# Altium schematic sheet Microcontroller (F446).SchDoc
size A3
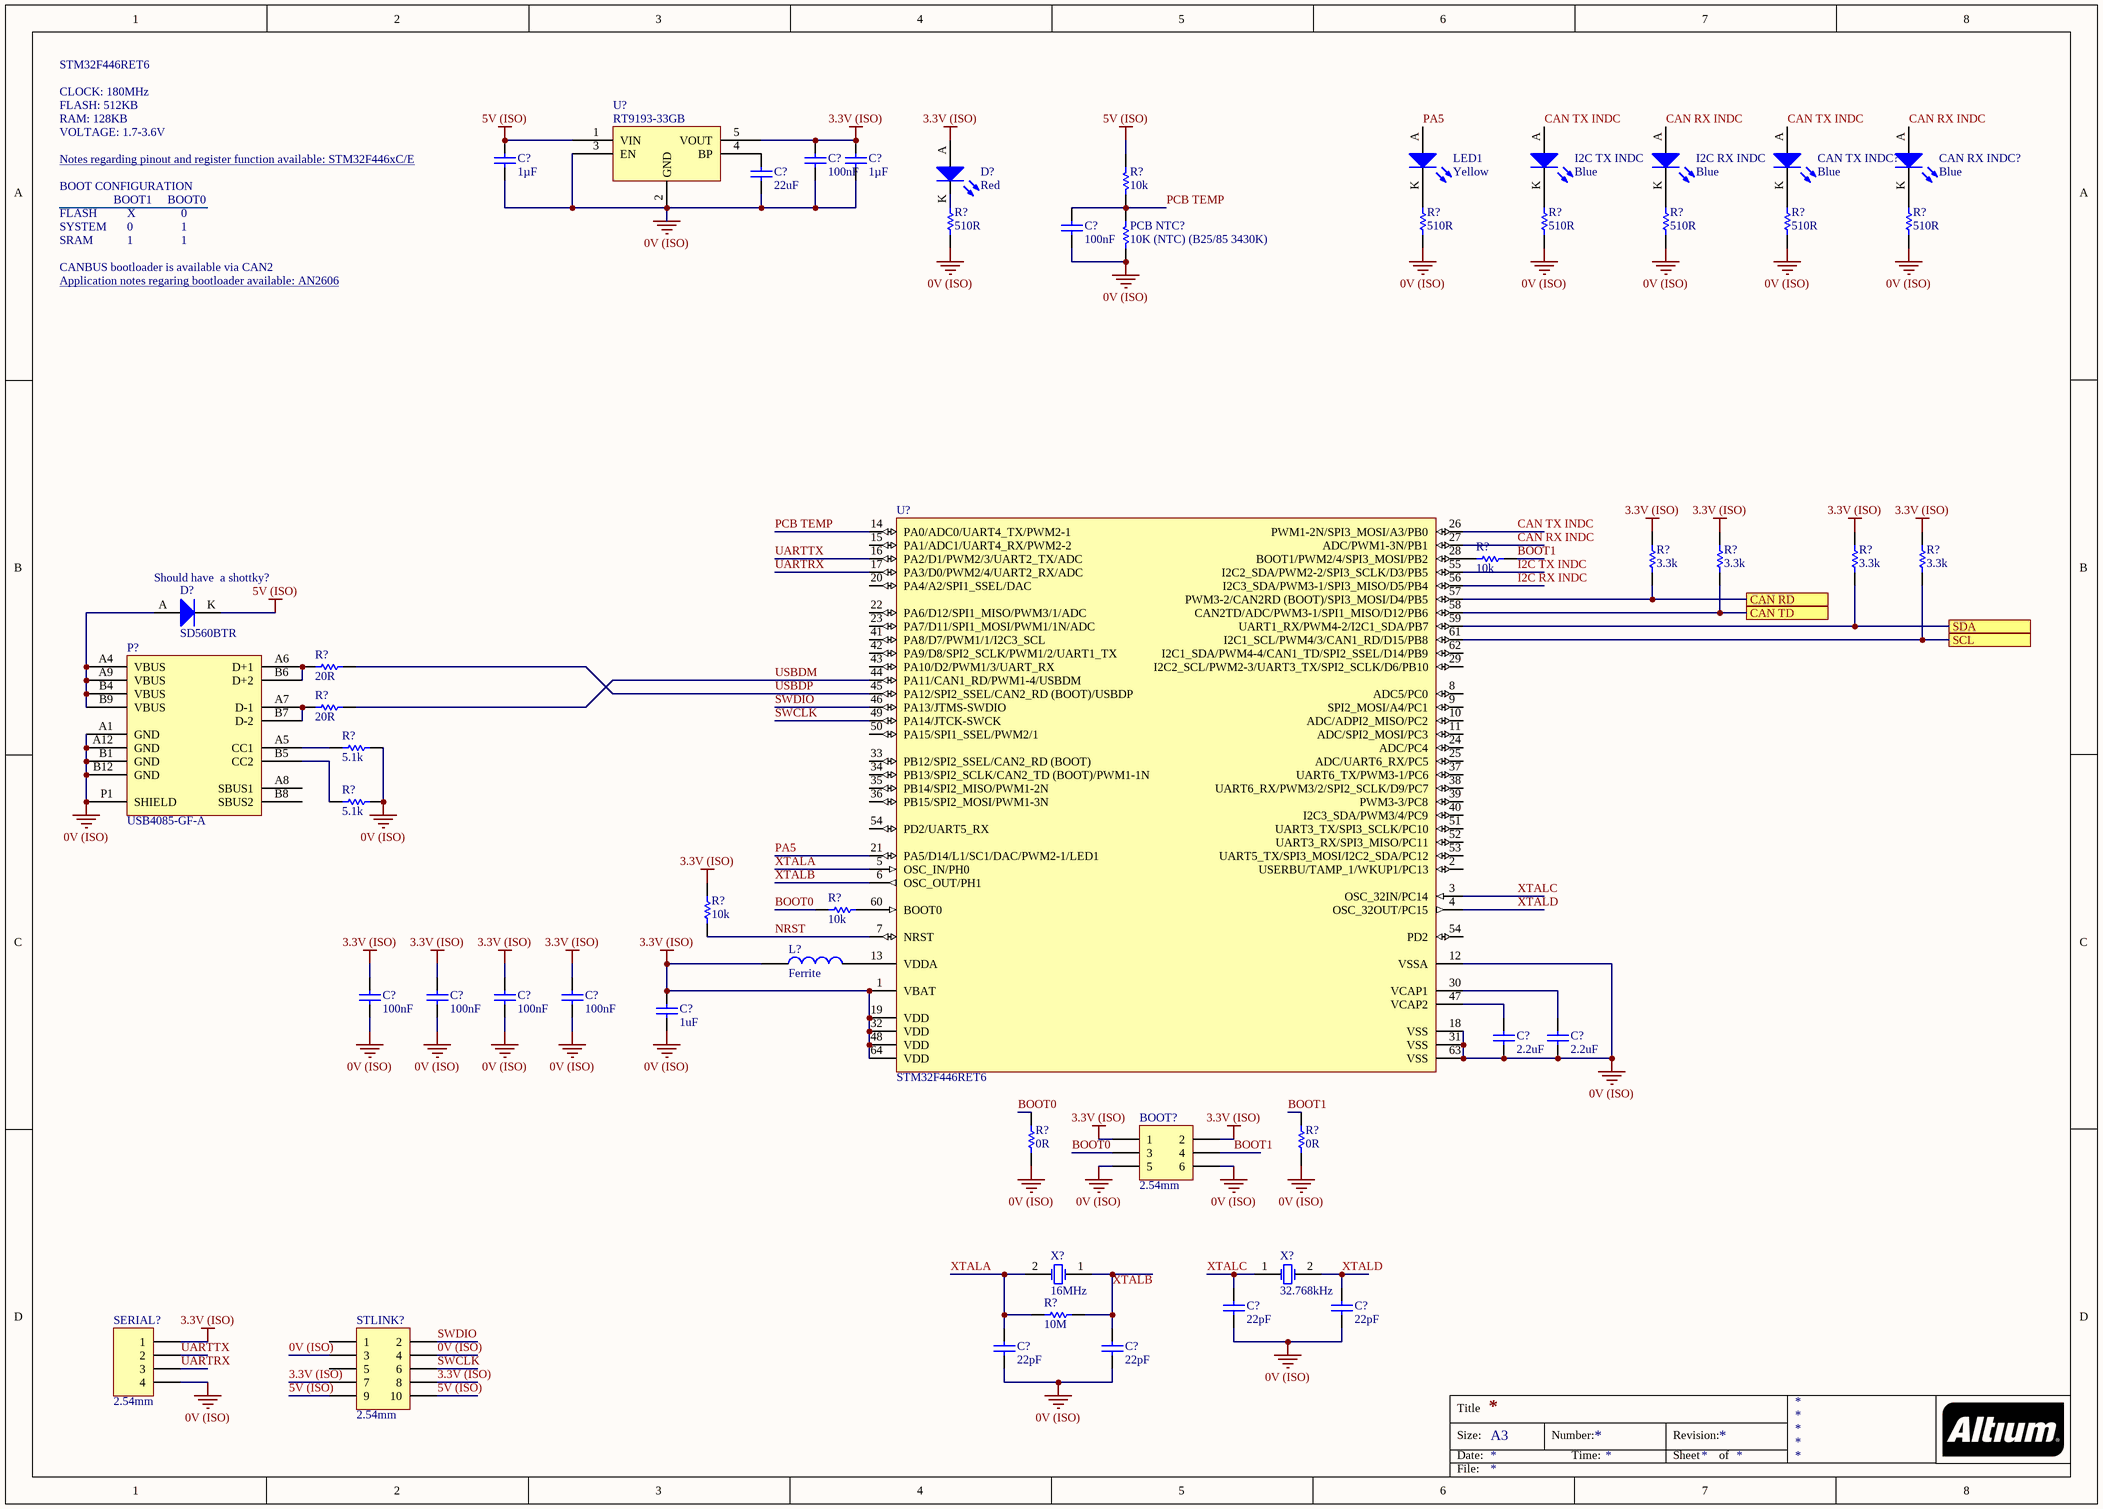
[diagram p0: Microcontroller (F446).SchDoc]

## Parts
(Parts that share a designator on the sheet are numbered #1, #2 ... from top to bottom, then left to right.)
BOOT?  2.54mm  [TH 2.54mm Header 2x3]
C?#1  1µF  [0805]
C?#2  100nF  [0805]
C?#3  1µF  [0805]
C?#4  22uF  [0805]
C?#5  100nF  [0805]
C?#6  100nF  [0805]
C?#7  100nF  [0805]
C?#8  100nF  [0805]
C?#9  100nF  [0805]
C?#10  1uF  [0805]
C?#11  2.2uF  [0805]
C?#12  2.2uF  [0805]
C?#13  22pF  [0805]
C?#14  22pF  [0805]
C?#15  22pF  [0805]
C?#16  22pF  [0805]
CAN_RX_INDC?  Blue  [0805 LED]
CAN_TX_INDC?  Blue  [0805 LED]
D?#1  Red  [0805 LED]
D?#2  SD560BTR  [SMB Diode]
I2C_RX_INDC  Blue  [0805 LED]
I2C_TX_INDC  Blue  [0805 LED]
L?  Ferrite  [0805]
LED1  Yellow  [0805 LED]
P?  USB4085-GF-A  [USB4085-GF-A]
PCB_NTC?  10K (NTC) (B25/85 3430K)  [0805]
R?#1  10k  [0805]
R?#2  510R  [0805]
R?#3  510R  [0805]
R?#4  510R  [0805]
R?#5  510R  [0805]
R?#6  510R  [0805]
R?#7  510R  [0805]
R?#8  10k  [0805]
R?#9  3.3k  [0805]
R?#10  3.3k  [0805]
R?#11  3.3k  [0805]
R?#12  3.3k  [0805]
R?#13  20R  [0805]
R?#14  20R  [0805]
R?#15  5.1k  [0805]
R?#16  5.1k  [0805]
R?#17  10k  [0805]
R?#18  10k  [0805]
R?#19  0R  [0805]
R?#20  0R  [0805]
R?#21  10M  [0805]
SERIAL?  2.54mm  [TH 2.54mm Header 1x4]
STLINK?  2.54mm  [TH 2.54mm Header 2x5]
U?#1  RT9193-33GB  [RICHTEK SOT-23-5]
U?#2  STM32F446RET6  [STM 64-LQFP]
X?#1  16MHz  [Abracon HC-49/US]
X?#2  32.768kHz  [EPSON 2-SMD]

## Ports
CAN RD, CAN TD, SCL, SDA

## Nets
0V (ISO): BOOT?.5 BOOT?.6 C?#1.1 C?#2.1 C?#3.1 C?#4.1 C?#5.1 C?#6.1 C?#7.1 C?#8.1 C?#9.1 C?#10.1 C?#11.1 C?#12.1 C?#13.1 C?#14.1 C?#15.1 C?#16.1 P?.A1(GND) P?.A12(GND) P?.B1(GND) P?.B12(GND) P?.P1(SHIELD) PCB_NTC?.1 R?#2.1 R?#3.1 R?#4.1 R?#5.1 R?#6.1 R?#7.1 R?#15.2 R?#16.2 R?#19.1 R?#20.1 SERIAL?.4 STLINK?.3 STLINK?.4 U?#1.2(GND) U?#1.3(EN) U?#2.12(VSSA) U?#2.18(VSS) U?#2.31(VSS) U?#2.63(VSS)
3.3V (ISO): BOOT?.1 BOOT?.2 C?#2.2 C?#3.2 C?#6.2 C?#7.2 C?#8.2 C?#9.2 C?#10.2 D?#1.A L?.2 R?#9.2 R?#10.2 R?#11.2 R?#12.2 R?#18.2 SERIAL?.1 STLINK?.7 STLINK?.8 U?#1.5(VOUT) U?#2.1(VBAT) U?#2.19(VDD) U?#2.32(VDD) U?#2.48(VDD) U?#2.64(VDD)
5V (ISO): C?#1.2 D?#2.K R?#1.2 STLINK?.9 STLINK?.10 U?#1.1(VIN)
BOOT0: BOOT?.3 R?#17.1 R?#19.2
BOOT1: BOOT?.4 R?#8.2 R?#20.2
CAN RD: R?#9.1 U?#2.57(PWM3-2/CAN2RD_(BOOT)/SPI3_MOSI/D4/PB5) ; port CAN RD
CAN RX INDC: CAN_RX_INDC?.A I2C_RX_INDC.A U?#2.27(ADC/PWM1-3N/PB1)
CAN TD: R?#10.1 U?#2.58(CAN2TD/ADC/PWM3-1/SPI1_MISO/D12/PB6) ; port CAN TD
CAN TX INDC: CAN_TX_INDC?.A I2C_TX_INDC.A U?#2.26(PWM1-2N/SPI3_MOSI/A3/PB0)
I2C RX INDC: U?#2.56(I2C3_SDA/PWM3-1/SPI3_MISO/D5/PB4)
I2C TX INDC: U?#2.55(I2C2_SDA/PWM2-2/SPI3_SCLK/D3/PB5)
NRST: R?#18.1 U?#2.7(NRST)
PA5: LED1.A U?#2.21(PA5/D14/L1/SC1/DAC/PWM2-1/LED1)
PCB TEMP: C?#5.2 PCB_NTC?.2 R?#1.1 U?#2.14(PA0/ADC0/UART4_TX/PWM2-1)
SCL: R?#12.1 U?#2.61(I2C1_SCL/PWM4/3/CAN1_RD/D15/PB8) ; port SCL
SDA: R?#11.1 U?#2.59(UART1_RX/PWM4-2/I2C1_SDA/PB7) ; port SDA
SWCLK: STLINK?.6 U?#2.49(PA14/JTCK-SWCK)
SWDIO: STLINK?.2 U?#2.46(PA13/JTMS-SWDIO)
UARTRX: SERIAL?.3 U?#2.17(PA3/D0/PWM2/4/UART2_RX/ADC)
UARTTX: SERIAL?.2 U?#2.16(PA2/D1/PWM2/3/UART2_TX/ADC)
USBDM: R?#14.2 U?#2.44(PA11/CAN1_RD/PWM1-4/USBDM)
USBDP: R?#13.2 U?#2.45(PA12/SPI2_SSEL/CAN2_RD_(BOOT)/USBDP)
XTALA: C?#15.2 R?#21.2 U?#2.5(OSC_IN/PH0) X?#1.2(OSC2)
XTALB: C?#16.2 R?#21.1 U?#2.6(OSC_OUT/PH1) X?#1.1(OSC1)
XTALC: C?#13.2 U?#2.3(OSC_32IN/PC14) X?#2.1(OSC1)
XTALD: C?#14.2 U?#2.4(OSC_32OUT/PC15) X?#2.2(OSC2)
NetC?#4_2: C?#4.2 U?#1.4(BP)
NetC?#11_2: C?#11.2 U?#2.47(VCAP2)
NetC?#12_2: C?#12.2 U?#2.30(VCAP1)
NetCAN_RX_INDC?_K: CAN_RX_INDC?.K R?#7.2
NetCAN_TX_INDC?_K: CAN_TX_INDC?.K R?#6.2
NetD?#1_K: D?#1.K R?#2.2
NetD?#2_A: D?#2.A P?.A4(VBUS) P?.A9(VBUS) P?.B4(VBUS) P?.B9(VBUS)
NetI2C_RX_INDC_K: I2C_RX_INDC.K R?#5.2
NetI2C_TX_INDC_K: I2C_TX_INDC.K R?#4.2
NetL?_1: L?.1 U?#2.13(VDDA)
NetLED1_K: LED1.K R?#3.2
NetP?_A5: P?.A5(CC1) R?#15.1
NetP?_A6: P?.A6(D+1) P?.B6(D+2) R?#13.1
NetP?_A7: P?.A7(D-1) P?.B7(D-2) R?#14.1
NetP?_B5: P?.B5(CC2) R?#16.1
NetR?#8_1: R?#8.1 U?#2.28(BOOT1/PWM2/4/SPI3_MOSI/PB2)
NetR?#17_2: R?#17.2 U?#2.60(BOOT0)

Not connected (* = marked no-connect by the designer): P? A8(SBUS1) B8(SBUS2); STLINK? 1 5; U?#2 2(USERBU/TAMP_1/WKUP1/PC13) 8(ADC5/PC0) 9(SPI2_MOSI/A4/PC1) 10(ADC/ADPI2_MISO/PC2) 11(ADC/SPI2_MOSI/PC3) 15(PA1/ADC1/UART4_RX/PWM2-2) 20(PA4/A2/SPI1_SSEL/DAC) 22(PA6/D12/SPI1_MISO/PWM3/1/ADC) 23(PA7/D11/SPI1_MOSI/PWM1/1N/ADC) 24(ADC/PC4) 25(ADC/UART6_RX/PC5) 29(I2C2_SCL/PWM2-3/UART3_TX/SPI2_SCLK/D6/PB10) 33(PB12/SPI2_SSEL/CAN2_RD_(BOOT)) 34(PB13/SPI2_SCLK/CAN2_TD_(BOOT)/PWM1-1N) 35(PB14/SPI2_MISO/PWM1-2N) 36(PB15/SPI2_MOSI/PWM1-3N) 37(UART6_TX/PWM3-1/PC6) 38(UART6_RX/PWM3/2/SPI2_SCLK/D9/PC7) 39(PWM3-3/PC8) 40(I2C3_SDA/PWM3/4/PC9) 41(PA8/D7/PWM1/1/I2C3_SCL) 42(PA9/D8/SPI2_SCLK/PWM1/2/UART1_TX) 43(PA10/D2/PWM1/3/UART_RX) 50(PA15/SPI1_SSEL/PWM2/1) 51(UART3_TX/SPI3_SCLK/PC10) 52(UART3_RX/SPI3_MISO/PC11) 53(UART5_TX/SPI3_MOSI/I2C2_SDA/PC12) 54(PD2) 62(I2C1_SDA/PWM4-4/CAN1_TD/SPI2_SSEL/D14/PB9)

## Notes on the sheet
- STM32F446RET6
- CLOCK: 180MHz
- FLASH: 512KB
- (near C?#1) Notes regarding pinout and register function available: STM32F446xC/E <https://www.st.com/content/ccc/resource/technical/document/datasheet/65/cb/75/50/53/d6/48/24/DM00141306.pdf/files/DM00141306.pdf/jcr:content/translations/en.DM00141306.pdf>
- RAM: 128KB
- VOLTAGE: 1.7-3.6V
- BOOT CONFIGURATION
- FLASH
- SYSTEM
- SRAM
- BOOT1
- X
- 1
- 0
- BOOT0
- CANBUS bootloader is available via CAN2
- Application notes regaring bootloader available: AN2606 <https://www.st.com/resource/en/application_note/cd00167594-stm32-microcontroller-system-memory-boot-mode-stmicroelectronics.pdf>
- (near D?#2) Should have  a shottky?
- Title
- Size:
- Date:
- A3
- Number:
- Time:
- Revision:
- Sheet
- of
- File:

## Library data of the parts
BOOT? = TH 2.54mm Header 2x3: Positions: 6; Angle: 0; Flange: No; Contact: NA; Part Number: TH 2.54mm Header 2x3; Pitch: 2.54mm; Row Spacing: 2.54mm
C?#1 C?#3 = GCM21BR71H105KA03L: Manufacturer: muRata; Tolerance: ±10%; Material: X7R; Rated Voltage: 50V; Part Number: GCM21BR71H105KA03L; Value: 1µF; Digikey Part Number: 490-10675-1-ND
C?#2 C?#6-C?#9 = GCM21BR71H104KA37L: Manufacturer: muRata; Tolerance: ±10%; Material: X7R; Rated Voltage: 50V; Part Number: GCM21BR71H104KA37L; Value: 100nF; Digikey Part Number: 490-6064-1-ND
C?#4 = GRM21BR61A226ME51L: Manufacturer: muRata; Tolerance: 20%; Material: X5R; Rated Voltage: 10V; Part Number: GRM21BR61A226ME51L; Value: 22uF; Digikey Part Number: 490-10511-1-ND
C?#5 = GCM21BR71E104KA37L: Manufacturer: muRata; Tolerance: 10%; Material: X7R; Rated Voltage: 25V; Part Number: GCM21BR71E104KA37L; Value: 100nF; Digikey Part Number: DO NOT USE FOR NEW DESIGNS
C?#10 = AC0805KKX7R8BB105: Manufacturer: YAGEO; Tolerance: 10%; Material: X7R; Rated Voltage: 25V; Part Number: AC0805KKX7R8BB105; Value: 1uF; Digikey Part Number: DO NOT USE FOR NEW DESIGNS
C?#11 C?#12 = GCM21BR61C225KA37L: Manufacturer: muRata; Tolerance: 10%; Material: X5R; Rated Voltage: 16V; Part Number: GCM21BR61C225KA37L; Value: 2.2uF; Digikey Part Number: DO NOT USE FOR NEW DESIGNS
C?#13-C?#16 = GRM21A5C2E220JW01D: Manufacturer: muRata; Tolerance: ±5%; Material: C0G, NP0; Rated Voltage: 250V; Part Number: GRM21A5C2E220JW01D; Value: 22pF; Digikey Part Number: 490-5534-1-ND
CAN_RX_INDC? CAN_TX_INDC? I2C_RX_INDC I2C_TX_INDC = SML-MN2BCTT86C: LED BLUE CLEAR 2012 SMD; Manufacturer: ROHM Semiconductor; Part Number: SML-MN2BCTT86C; Colour: Blue; Digikey Part Number: 846-1207-1-ND; Digikey Link: https://www.digikey.com/product-detail/en/rohm-semiconductor/SMLMN2BCTT86C/846-1207-1-ND/6057239
D?#1 = SML-210LTT86: Red LED Indication - Discrete 1.75V 0805 (2012 Metric); Manufacturer: ROHM Semiconductor; Part Number: SML-210LTT86; Colour: Red; Digikey Part Number: 511-1286-1-ND; Digikey Link: https://www.digikey.com/product-detail/en/rohm-semiconductor/SML-210LTT86/511-1286-1-ND/637099
D?#2 = SD560BTR: 1.2V_F 600V 5A SMB; Manufacturer: SMC Diode Solutions; Part Number: SD560BTR; Digikey Part Number: 1655-1530-2-ND; Digikey Link: https://www.digikey.com/product-detail/en/smc-diode-solutions/SD560BTR/1655-1530-2-ND/6022620
L? = MMZ2012Y202BTD25: Manufacturer: TDK Corportation; Impedence: 2 kOhms @ 100MHz; Material: Ferrite Bead; Rated Current: 400mA; Part Number: MMZ2012Y202BTD25; Value: Ferrite; Digikey Part Number: 445-172872-1-ND
LED1 = SML-211YTT86: Yellow LED Indication - Discrete 1.75V 0805 (2012 Metric); Manufacturer: ROHM Semiconductor; Part Number: SML-211YTT86; Colour: Yellow; Digikey Part Number: 511-1293-1-ND; Digikey Link: https://www.digikey.com/product-detail/en/rohm-semiconductor/SML-211YTT86/511-1293-1-ND/637106
P? = USB4085-GF-A: USB - C (Type - C) USB 2.0 Receptacle Connector 16 Position Through Hole, Right Angle; Angle: 90; Part Number: USB4085-GF-A; Digikey Part Number: 2073-USB4085-GF-ACT-ND; Digikey Link: https://www.digikey.ee/product-detail/en/gct/USB4085-GF-A/2073-USB4085-GF-ACT-ND/9859733
PCB_NTC? = NTCS0805E3103FLT: Manufacturer: Vishay Beyschlag; Tolerance: 0.01; Rated Voltage: 210mW; Part Number: NTCS0805E3103FLT; Value: 10K (NTC) (B25/85 3430K); Digikey Part Number: BC2733CT-ND
R?#1 R?#8 R?#17 R?#18 = RC0805FR0710KL: Manufacturer: YAGEO; Tolerance: 0.01; Rated Voltage: 0.125W; Part Number: RC0805FR0710KL; Value: 10k; Material: FR-07; Digikey Part Number: 311-10.0KCRCT-ND
R?#2-R?#7 = RC0805FR07510RL: Manufacturer: YAGEO; Tolerance: 0.01; Rated Voltage: 0.125W; Part Number: RC0805FR07510RL; Value: 510R; Material: FR-07; Digikey Part Number: 311-510CRCT-ND
R?#9-R?#12 = RC0805FR073K3L: Manufacturer: YAGEO; Tolerance: 0.01; Rated Voltage: 0.125W; Part Number: RC0805FR073K3L; Value: 3.3k; Material: FR-07; Digikey Part Number: 311-3.30KCRCT-ND
R?#13 R?#14 = RC0805FR0720RL: Manufacturer: YAGEO; Tolerance: 0.01; Rated Voltage: 0.125W; Part Number: RC0805FR0720RL; Value: 20R; Material: FR-07; Digikey Part Number: 311-20.0CRCT-ND
R?#15 R?#16 = RC0805FR075K1L: Manufacturer: YAGEO; Tolerance: 0.01; Rated Voltage: 0.125W; Part Number: RC0805FR075K1L; Value: 5.1k; Material: FR-07; Digikey Part Number: 311-5.10KCRCT-ND
R?#19 R?#20 = RC0805FR070RL: Manufacturer: YAGEO; Tolerance: 0.01; Rated Voltage: 0.125W; Part Number: RC0805FR070RL; Value: 0R; Material: FR-07; Digikey Part Number: 311-0.0CRCT-ND
R?#21 = RC0805FR0710ML: Manufacturer: YAGEO; Tolerance: 0.01; Rated Voltage: 0.125W; Part Number: RC0805FR0710ML; Value: 10M; Material: FR-07; Digikey Part Number: 311-10.0MCRCT-ND
SERIAL? = TH 2.54mm Header 1x4: Positions: 4; Angle: 0; Flange: No; Contact: NA; Part Number: TH 2.54mm Header 1x4; Pitch: 2.54mm; Row Spacing: 2.54mm
STLINK? = TH 2.54mm Header 2x5: Positions: 10; Angle: 0; Flange: No; Contact: NA; Part Number: TH 2.54mm Header 2x5; Pitch: 2.54mm; Row Spacing: 2.54mm
U?#1 = RT9193-33GB: Linear Voltage Regulator IC 1 Output 300mA SOT-23-5; Manufacturer: Richtek; Input Voltage: 5.5V-0.3V; Output Voltage: 3.3V; Output Power: 1W; Efficiency: 0.5; Isolation: Non-Isolated; Part Number: RT9193-33GB; Digikey Part Number: 1028-1014-1-ND; Digikey Link: https://www.digikey.com/products/en?keywords=1028-1014-1-ND
U?#2 = STM32F446RET6: ARM® Cortex®-M4 STM32F4 Microcontroller IC 32-Bit 180MHz 512KB (512K x 8) FLASH 64-LQFP (10x10); Manufacturer: STMicroelectronics; Part Number: STM32F446RET6; Digikey Part Number: 497-15376-ND; Digikey Link: https://www.digikey.com.au/product-detail/en/stmicroelectronics/STM32F446RET6/497-15376-ND/5175962
X?#1 = ABLS-16.000MHZ-B4-T: Manufacturer: Abracon LLC; Load Capacitance: 18pF; ESR: 40R; Part Number: ABLS-16.000MHZ-B4-T; Digikey Part Number: 535-10226-1-ND; Digikey Link: https://www.digikey.com/product-detail/en/abracon-llc/ABLS-16.000MHZ-B4-T/535-10226-1-ND/2184261; Value: 16MHz
X?#2 = FC-135 32.7680KA-A5: Manufacturer: EPSON; Load Capacitance: 12.5pF; ESR: 70k; Part Number: FC-135 32.7680KA-A5; Value: 32.768kHz; Digikey Part Number: SER4103TR-ND; Digikey Link: https://www.digikey.com/product-detail/en/epson/FC-135-32.7680KA-A5/SER4103TR-ND/5259895